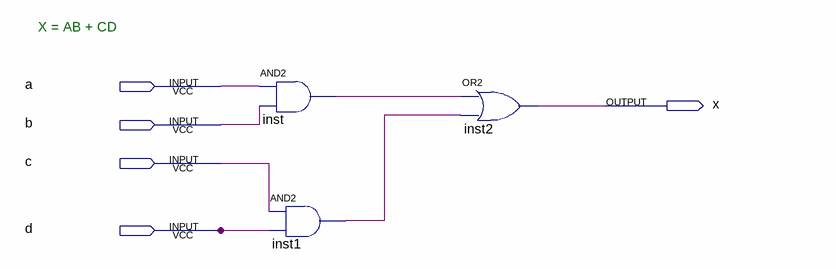
[diagram p0: schematic sheet]
// Quartus schematic boolean1.bdf as structural Verilog: 3 symbols, 5 pins
module boolean1 (
  input  a,
  input  b,
  input  c,
  input  d,
  output x
);

  wire inst1_out, inst_out;

  and inst (inst_out, a, b);
  and inst1 (inst1_out, c, d);
  or inst2 (x, inst_out, inst1_out);

  // Notes on the sheet:
  //   X = AB + CD
endmodule
